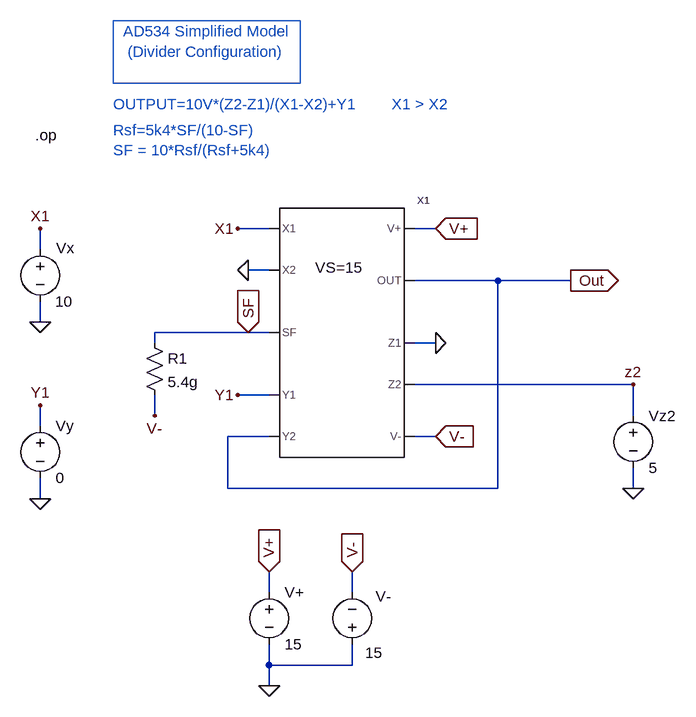
[diagram p0: schematic AD534_divtest_hy.asc]
AD534_divtest_hy.asc, the LTspice schematic file:
Version 4
SHEET 1 1640 868
WIRE -144 64 -144 32
WIRE -144 176 -144 144
WIRE -144 336 -144 304
WIRE -144 448 -144 416
WIRE 32 208 32 192
WIRE 32 320 32 288
WIRE 144 432 144 352
WIRE 176 192 32 192
WIRE 208 32 160 32
WIRE 208 96 176 96
WIRE 208 192 176 192
WIRE 208 288 160 288
WIRE 208 352 144 352
WIRE 208 592 208 560
WIRE 208 704 208 672
WIRE 208 736 208 704
WIRE 336 592 336 560
WIRE 336 704 208 704
WIRE 336 704 336 672
WIRE 464 32 432 32
WIRE 464 208 432 208
WIRE 464 352 432 352
WIRE 560 112 432 112
WIRE 560 432 144 432
WIRE 560 432 560 112
WIRE 672 112 560 112
WIRE 768 272 432 272
WIRE 768 320 768 272
WIRE 768 432 768 400
FLAG 464 32 V+
IOPIN 464 32 In
FLAG 464 352 V-
IOPIN 464 352 In
FLAG 160 32 X1
FLAG 672 112 Out
IOPIN 672 112 Out
FLAG 208 736 0
FLAG 208 560 V+
IOPIN 208 560 In
FLAG 336 560 V-
IOPIN 336 560 In
FLAG -144 32 X1
FLAG -144 304 Y1
FLAG -144 176 0
FLAG -144 448 0
FLAG 176 192 SF
IOPIN 176 192 In
FLAG 176 96 0
FLAG 768 272 z2
FLAG 768 432 0
FLAG 32 320 V-
FLAG 464 208 0
FLAG 160 288 Y1
SYMBOL voltage 208 576 R0
SYMATTR InstName V+
SYMATTR Value 15
SYMBOL voltage 336 688 R180
WINDOW 0 -60 90 Left 0
WINDOW 3 -47 3 Left 0
SYMATTR InstName V-
SYMATTR Value 15
SYMBOL voltage -144 48 M0
WINDOW 0 -52 14 Left 0
WINDOW 3 -50 96 Left 0
SYMATTR InstName Vx
SYMATTR Value 10
SYMBOL voltage -144 320 R0
SYMATTR InstName Vy
SYMATTR Value 0
SYMBOL voltage 768 304 R0
SYMATTR InstName Vz2
SYMATTR Value 5
SYMBOL res 16 192 R0
SYMATTR InstName R1
SYMATTR Value 5.4g
SYMBOL ad534hy 320 192 R0
WINDOW 39 -41 -100 Left 0
SYMATTR InstName X1
SYMATTR SpiceLine VS=15
TEXT -152 -112 Left 0 !.op
TEXT -32 -120 Left 0 ;Rsf=5k4*SF/(10-SF)\nSF = 10*Rsf/(Rsf+5k4)
TEXT 112 -256 Center 0 ;AD534 Simplified Model\n(Divider Configuration)
TEXT -32 -160 Left 0 ;OUTPUT=10V*(Z2-Z1)/(X1-X2)+Y1        X1 > X2
RECTANGLE Normal 256 -192 -32 -288

The netlist it stands for:
* AD534_divtest_hy.asc
V+ V+ 0 15
V- 0 V- 15
Vx X1 0 10
Vy Y1 0 0
Vz2 z2 0 5
R1 SF V- 5.4g
XX1 X1 0 SF Y1 Out V+ Out 0 z2 V- ad534hy params: VS=15  ; pins X1 X2 SF Y1 Y2 V+ OUT Z1 Z2 V-
.op
* Rsf=5k4*SF/(10-SF)
* SF = 10*Rsf/(Rsf+5k4)
* AD534 Simplified Model
* (Divider Configuration)
* OUTPUT=10V*(Z2-Z1)/(X1-X2)+Y1        X1 > X2
.backanno
.end